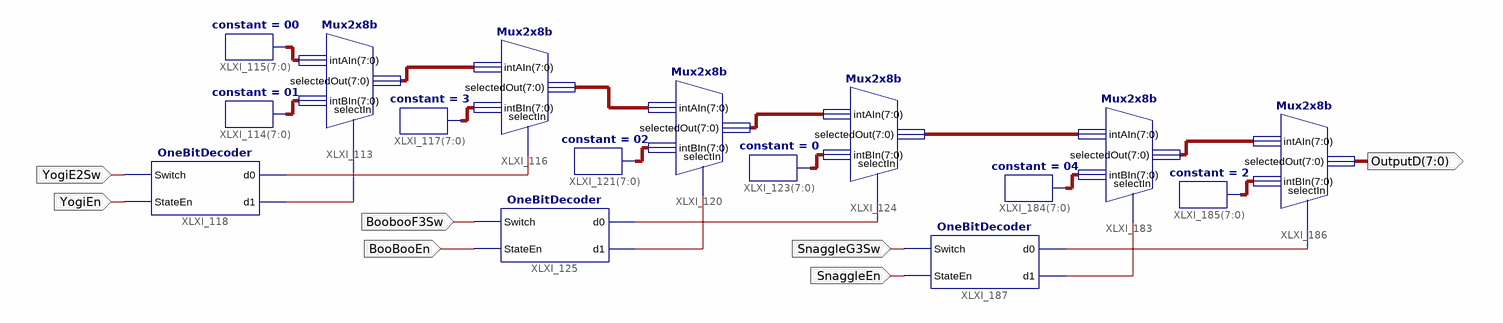
[diagram p0: schematic sheet 1]
// Xilinx ISE schematic MultiOneBitDecoder.sch (spartan3e) as structural Verilog: 16 symbols, 7 ports
module MultiOneBitDecoder (
  input  YogiE2Sw,
  input  YogiEn,
  input  BoobooF3Sw,
  input  BooBooEn,
  input  SnaggleG3Sw,
  input  SnaggleEn,
  output [7:0] OutputD
);

  wire XLXN_566, XLXN_567, XLXN_576, XLXN_577, XLXN_681, XLXN_682;
  wire [7:0] XLXN_554, XLXN_555, XLXN_557, XLXN_560, XLXN_571, XLXN_572, XLXN_574, XLXN_675, XLXN_676,
       XLXN_677, XLXN_679, XLXN_684;

  Mux2x8b XLXI_113 (.selectedOut(XLXN_557), .selectIn(XLXN_567), .intBIn(XLXN_555), .intAIn(XLXN_554));
  constant #(.CValue("01")) XLXI_114[7:0] (.O(XLXN_555));
  constant #(.CValue("00")) XLXI_115[7:0] (.O(XLXN_554));
  constant #(.CValue("3")) XLXI_117[7:0] (.O(XLXN_560));
  Mux2x8b XLXI_116 (.selectedOut(XLXN_675), .selectIn(XLXN_566), .intBIn(XLXN_560), .intAIn(XLXN_557));
  OneBitDecoder XLXI_118 (.Switch(YogiE2Sw), .StateEn(YogiEn), .d0(XLXN_566), .d1(XLXN_567));
  OneBitDecoder XLXI_125 (.Switch(BoobooF3Sw), .StateEn(BooBooEn), .d0(XLXN_576), .d1(XLXN_577));
  Mux2x8b XLXI_124 (.selectedOut(XLXN_684), .selectIn(XLXN_576), .intBIn(XLXN_572), .intAIn(XLXN_574));
  constant #(.CValue("0")) XLXI_123[7:0] (.O(XLXN_572));
  constant #(.CValue("02")) XLXI_121[7:0] (.O(XLXN_571));
  Mux2x8b XLXI_120 (.selectedOut(XLXN_574), .selectIn(XLXN_577), .intBIn(XLXN_571), .intAIn(XLXN_675));
  Mux2x8b XLXI_183 (.selectedOut(XLXN_679), .selectIn(XLXN_682), .intBIn(XLXN_676), .intAIn(XLXN_684));
  constant #(.CValue("04")) XLXI_184[7:0] (.O(XLXN_676));
  constant #(.CValue("2")) XLXI_185[7:0] (.O(XLXN_677));
  Mux2x8b XLXI_186 (.selectedOut(OutputD), .selectIn(XLXN_681), .intBIn(XLXN_677), .intAIn(XLXN_679));
  OneBitDecoder XLXI_187 (.Switch(SnaggleG3Sw), .StateEn(SnaggleEn), .d0(XLXN_681), .d1(XLXN_682));
endmodule
